# EAGLE design RPi-Adapter (EAGLE 6.6.0)
Assembly variants: RPi-Adapter, Slave-Board

## Sheet 1 of 6: RaspberryPi 3 Interface Hardware Prozessor Der RaspberryPi3 ist ein Ein-Platinen-Computer auf der Grundlage der ARM-Prozessorarchitektur. welche durch die Firma Broadcom lizensiert und im SoC BCM2837 <https://www.raspberrypi.org/wp-content/uploads/2012/02/BCM2835-ARM-Peripherals.pdf> implementiert wurde. Es handelt sich dabei um eine Quad-Core-SMP-Architektur mit einem Basistakt von 1.2Ghz und einer Adressbreite von 64-Bit. GPU Der BCM2835-Prozessor ist als System-On-Chip konzipiert und stellt einen Grafikprozessor auf der Grundlage der Broadcom-VideoCore IV <http://elinux.org/Raspberry_Pi_VideoCore_APIs> IP bereit. Diese ist in der Lage, Full-HD-Videos abzuspielen und stellt auch OpenGL ES 2.0 bzw. OpenVG für Anwendungen bereit. Speicher Wie für fast jegliche Art von Computersystem ist auch für den RaspberryPi3 eine Speicherhierarchie definiert. Der schnelle, aber flüchtige Arbeitsspeicher (RAM) des RaspberryPi ist mit 900Mhz getaktet (LPDDR2) und steht in einer Kapazität von 1GB bereit. Das langsame, aber persistente Halten von Daten wird durch eine externe SD-Karte realisiert. Netzwerk Ein wesentlicher Unterschied neben der erhöhten Performance gegenüber dem RaspberryPi2 ist eine neu hinzugekommene Wireless-Funktionalität. So ist der RPi3 bereits im Auslieferungszustand in der Lage, Bluetooth-LowEnergy und WLAN-Verbindungen (IEEE802.11n) herzustellen. Diese Funktionalität wird über den Chipsatz BCM43143 <http://www.cypress.com/file/298756/download> realisiert. Zusätzlich steht wie in den Vorgängermodellen des RPi eine RJ45-Schnittstelle bereit, über die 100MBit-Ethernetverbindungen hergestellt werden können. Peripherie Zusätzliche Komponenten des RaspberryPi3 sind die erweiterte Anzahl von USB-Schnittstellen (4x USB 2.0 gegenüber den 2xUSB1.1 vom ursprünglichen Board aus dem Jahre 2012), welche über das Bauteil SMSC LAN 9514 <http://ww1.microchip.com/downloads/en/DeviceDoc/9514.pdf> realisiert wird (dieses implementiert gleichzeitig auch den Ethernet-Stack). Daneben ist für den RPi3 auch eine CSI-Kameraschnittstelle für serielle Datenübertragung von HD-Kameramodulen vorgesehen, mit der entsprechende Kameramodule hochauflösend an den BCM-Prozessor angebunden werden können. Zur Darstellung der Benutzeroberfläche dient eine HDMI- und eine DSI-Displayschnittstelle, über die mittels Differenzsignalen hochfrequent und störungsfrei Daten zu Displays übertragen werden können (LVDS). Dies entspricht im Wesentlichen dem Verhalten der HDMI-Schnittstelle, welche zum Anschluss externer Monitore bereitsteht und deren LVDS-Signale durch die oben genannte VideoCore-GPU generiert werden. Zur Ausgabe akustischer Signale (Soundkarte) steht ein kombinierter A/V-Adapter zur Verfügung, der durch eine 3.5mm Klinkenstecker eine Stereoausgabe ermöglicht. Zusätzlich wird über einen dritten Kanal ein Composite-Videosignal (PAL/NTSC) bereitgestellt, was zur Videoausgabe auf nicht-HDMI-kompatibler Hardware verwendet werden kann. Erweiterungen Für das hier dokumentierte Projekt ist allerdings eine andere Eigenschaft des RaspberryPi entscheidend: der RaspberryPi 3 besitzt nämlich eine 40-polige Steckerleiste zur Anbindung externer Peripherie. Darüber können universell benutzbare Ein-/Ausgabe-Pins (GPIO=General Purpose I/O) mit LVTTL Pegeln (3.3V) geschaltet bzw. hochohmig gelesen werden. Manche dieser GPIO Pins besitzen eine Doppelbelegung, die bei Konfiguration der richtigen Register des BroadCom-SoCs die Zweitfunktionalität freischaltet. Dies betrifft z.B. Platinenbusse wie SPI oder I²C, die Ansteuerung von RS232-/ oder RS485-Treibern (UART), aber auch die Generierung von externen Signalformen mittels Hardware-unterstützter Pulsweitenmodulation (PWM). Maximal belastbar sind die GPIO-Ausgabekanäle mit 50mA, was zum direkten Schalten von LEDs ausreicht, für größere Lasten aber Bipolar- bzw. Feldeffekttransistoren benötigt. Betriebssystem Der RaspberryPi kann mit verschiedenen Betriebssystemen betrieben werden. Unter anderem stehen verschiedene Linux-Distributionen wie Raspbian oder das für MediaCenter optimierte OpenELEC <http://www.openelec.tv> zur Verfügung. Auch eine Verwendung mit Microsoft-Plattformen ist möglich, so kann etwa auch Windows10-IoT <https://developer.microsoft.com/de-de/windows/iot> für den RaspberryPi3 verwendet werden. Programmierung Zur Programmierung eigener Anwendungen ist für Linux-Betriebssysteme die Programmiersprache Python <http://www.python.org> das Mittel der Wahl. Sie stellt eine sehr einfache und für Einsteiger leicht zu erlernende Syntax bereit und kann durch PyQT <https://riverbankcomputing.com/software/pyqt/intro> leicht grafische Anwendungen erzeugen. Zur Ansteuerung der GPIOs kann die Softwarekomponente WiringPi <http://raspberrypiguide.de/howtos/raspberry-pi-gpio-how-to/> genutzt werden. Neben Python stehen auch Compiler für Programmiersprachen wie C/C++, Java oder ADA <http://www.adacore.com/press/adacore-introduces-gnat-gpl-2015-for-the-raspberry-pi-2/> bereit. Für die Verwendung von Windows 10 IoT muss statt dessen das VisualStudio 2015 <https://developer.microsoft.com/en-us/windows/iot/docs/setuppcrpi> verwendet werden. Damit wird eine Programmierung mit C# und dem .NET Framework möglich.
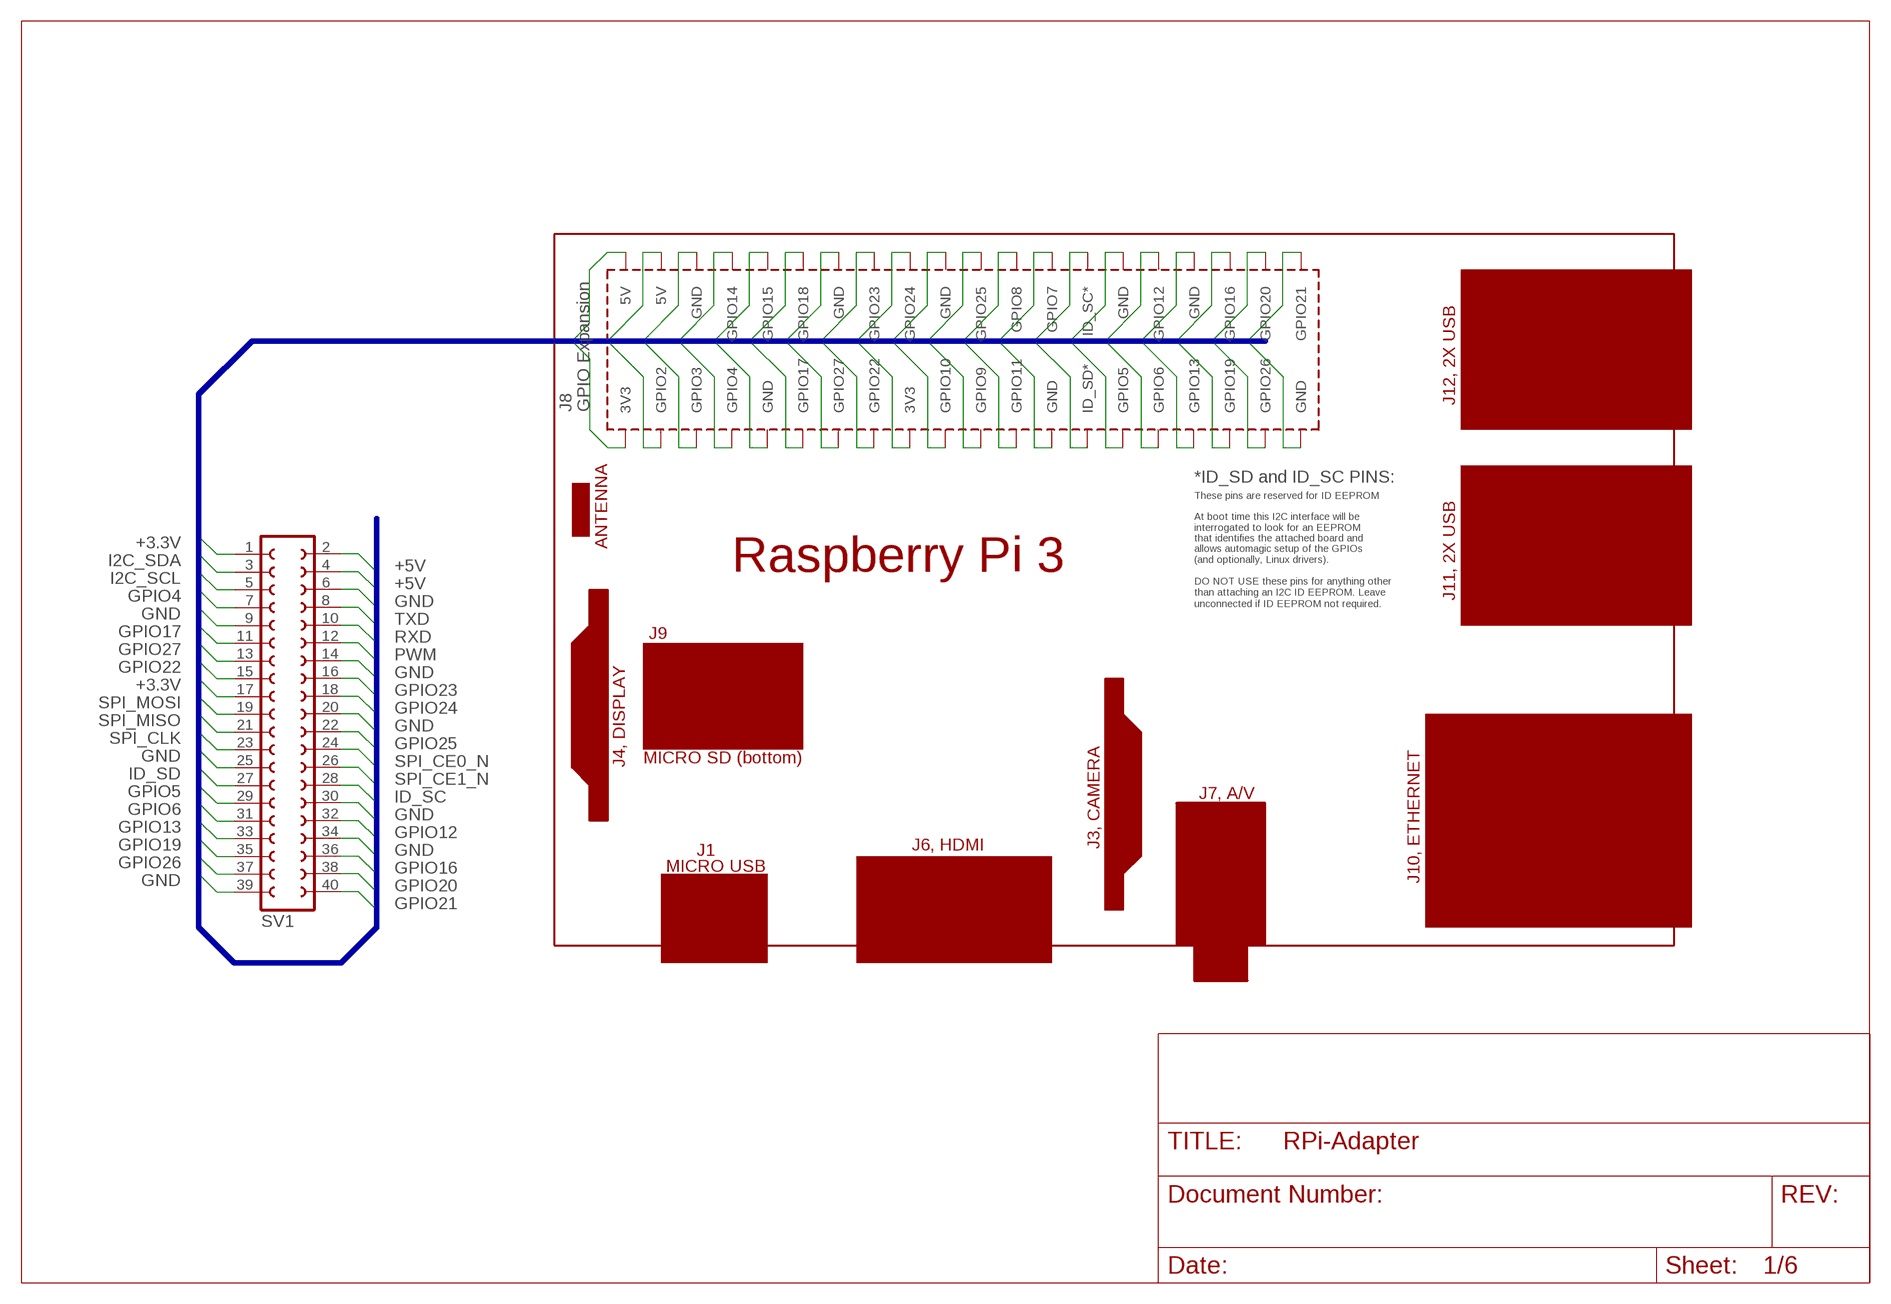
[diagram p0: schematic, sheet 1]

### Parts
PCB1  RPI3_EXT  (no package)
SV1  FE20-2  [FE20-2]  (not fitted in variant Slave-Board)

### Nets
+3.3V: PCB1.3V3 SV1.1 SV1.17 ; also sheet 2,3,5,6
+5V: PCB1.5V SV1.2 SV1.4 ; also sheet 3
GND: PCB1.GND SV1.6 SV1.9 SV1.14 SV1.20 SV1.25 SV1.30 SV1.34 SV1.39 ; also sheet 2,3,4,5,6
GPIO4: PCB1.GPIO4 SV1.7 ; also sheet 2,4
GPIO5: PCB1.GPIO5 SV1.29
GPIO6: PCB1.GPIO6 SV1.31
GPIO12: PCB1.GPIO12 SV1.32
GPIO13: PCB1.GPIO13 SV1.33
GPIO16: PCB1.GPIO16 SV1.36
GPIO17: PCB1.GPIO17 SV1.11
GPIO19: PCB1.GPIO19 SV1.35
GPIO20: PCB1.GPIO20 SV1.38
GPIO21: PCB1.GPIO21 SV1.40
GPIO22: PCB1.GPIO22 SV1.15
GPIO23: PCB1.GPIO23 SV1.16
GPIO24: PCB1.GPIO24 SV1.18
GPIO25: PCB1.GPIO25 SV1.22
GPIO26: PCB1.GPIO26 SV1.37
GPIO27: PCB1.GPIO27 SV1.13
I2C_SCL: PCB1.GPIO3 SV1.5 ; also sheet 2,3,4,5
I2C_SDA: PCB1.GPIO2 SV1.3 ; also sheet 2,3,4,5
ID_SC: PCB1.ID_SC* SV1.28
ID_SD: PCB1.ID_SD* SV1.27
PWM: PCB1.GPIO18 SV1.12 ; also sheet 3
RXD: PCB1.GPIO15 SV1.10 ; also sheet 3
SPI_CE0_N: PCB1.GPIO8 SV1.24 ; also sheet 3
SPI_CE1_N: PCB1.GPIO7 SV1.26 ; also sheet 3
SPI_CLK: PCB1.GPIO11 SV1.23 ; also sheet 3
SPI_MISO: PCB1.GPIO9 SV1.21 ; also sheet 3
SPI_MOSI: PCB1.GPIO10 SV1.19 ; also sheet 3
TXD: PCB1.GPIO14 SV1.8 ; also sheet 3

### Buses
+5V,+3.3V,GND,ID_SD,ID_SC,I2C_SDA,I2C_SCL,GPIO4,GPIO5,GPIO6,SPI_CE1_N,SPI_CE0_N,SPI_MISO,SPI_MOSI,SPI_CLK,GPIO12,GPIO13,TXD,RXD,GPIO16,GPIO17,PWM,GPIO19,GPIO20,GPIO21,GPIO22,GPIO23,GPIO24,GPIO25,GPIO26,GPIO27

## Sheet 2 of 6: GPIO-Extender Hauptkomponente des Projekts ist der integrierte Schaltkreis MCP23017 <http://cdn-reichelt.de/documents/datenblatt/A200/DS_MCP23017.pdf>, der als GPIO-Extender fungiert und über den I²C-Bus vom RaspberryPi aus gesteuert werden kann. Die wesentliche Aufgabe des Bausteins ist die Behebung der Limitierung von I/O-Ports. Der RaspberryPi kann als I²C-Master theoretisch bis zu 127 Slaves adressieren, die Einschränkung soll hier bei maximal 8 Teilnehmern liegen. Der MCP23017 unterstützt zwei Kanäle mit je einer Breite von 8-Bit. Durch Konfiguration eines Datenrichtungsregisters können deren Pins zwischen Input- und Output umgeschaltet werden.
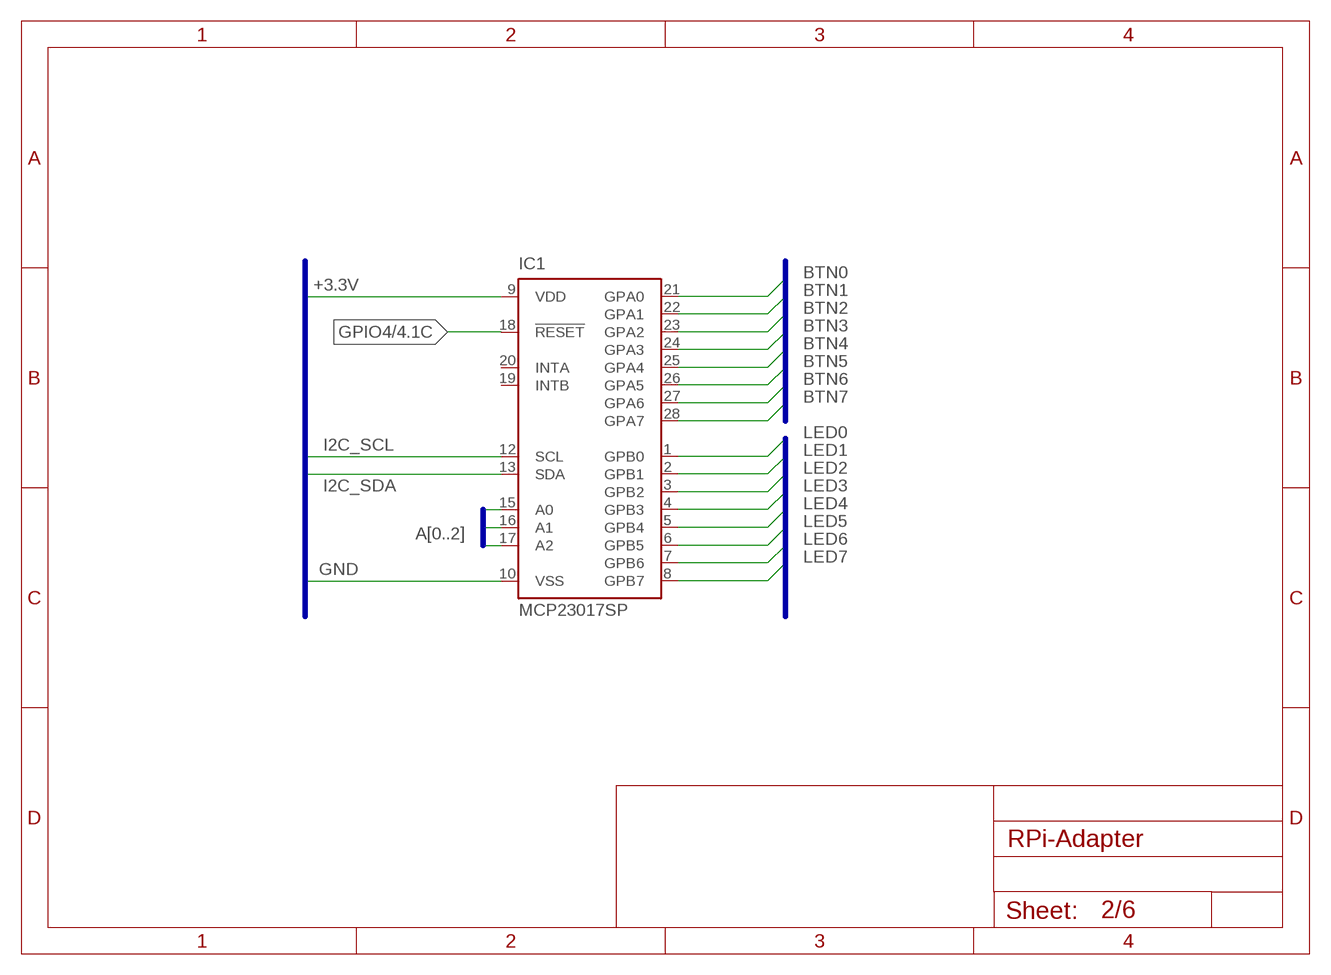
[diagram p1: schematic, sheet 2]

### Parts
IC1  MCP23017SP  [DIL28-3]

### Nets
+3.3V: IC1.9(VDD) ; also sheet 1,3,5,6
A0: IC1.15(A0) ; also sheet 5
A1: IC1.16(A1) ; also sheet 5
A2: IC1.17(A2) ; also sheet 5
BTN0: IC1.21(GPA0) ; also sheet 3
BTN1: IC1.22(GPA1) ; also sheet 3
BTN2: IC1.23(GPA2) ; also sheet 3
BTN3: IC1.24(GPA3) ; also sheet 3
BTN4: IC1.25(GPA4) ; also sheet 3
BTN5: IC1.26(GPA5) ; also sheet 3
BTN6: IC1.27(GPA6) ; also sheet 3
BTN7: IC1.28(GPA7) ; also sheet 3
GND: IC1.10(VSS) ; also sheet 1,3,4,5,6
GPIO4: IC1.18(!RESET) ; also sheet 1,4
I2C_SCL: IC1.12(SCL) ; also sheet 1,3,4,5
I2C_SDA: IC1.13(SDA) ; also sheet 1,3,4,5
LED0: IC1.1(GPB0) ; also sheet 3
LED1: IC1.2(GPB1) ; also sheet 3
LED2: IC1.3(GPB2) ; also sheet 3
LED3: IC1.4(GPB3) ; also sheet 3
LED4: IC1.5(GPB4) ; also sheet 3
LED5: IC1.6(GPB5) ; also sheet 3
LED6: IC1.7(GPB6) ; also sheet 3
LED7: IC1.8(GPB7) ; also sheet 3
Unconnected: IC1.19(INTB) IC1.20(INTA)

### Buses
BTN[0..7]
LED[0..7]
+5V,+3.3V,GND,ID_SD,ID_SC,I2C_SDA,I2C_SCL,GPIO4,GPIO5,GPIO6,GPIO7,GPIO8,GPIO9,GPIO10,GPIO11,GPIO12,GPIO13,GPIO14,GPIO15,GPIO16,GPIO17,PWM,GPIO19,GPIO20,GPIO21,GPIO22,GPIO23,GPIO24,GPIO25,GPIO26,GPIO27
A[0..2]

## Sheet 3 of 6: Expansion-Header Die Expansion-Header entsprechen Stiftleisten zur Erweiterung der Funktionalität. So können für ein bestimmte Einsatzzweck erstellte Lochraster- bzw. Platinenaufbauten mit dem Board verwendet werden, solange sie den gleichen Footprint verwenden und die elektrischen Gegebenheiten passend antizipieren.
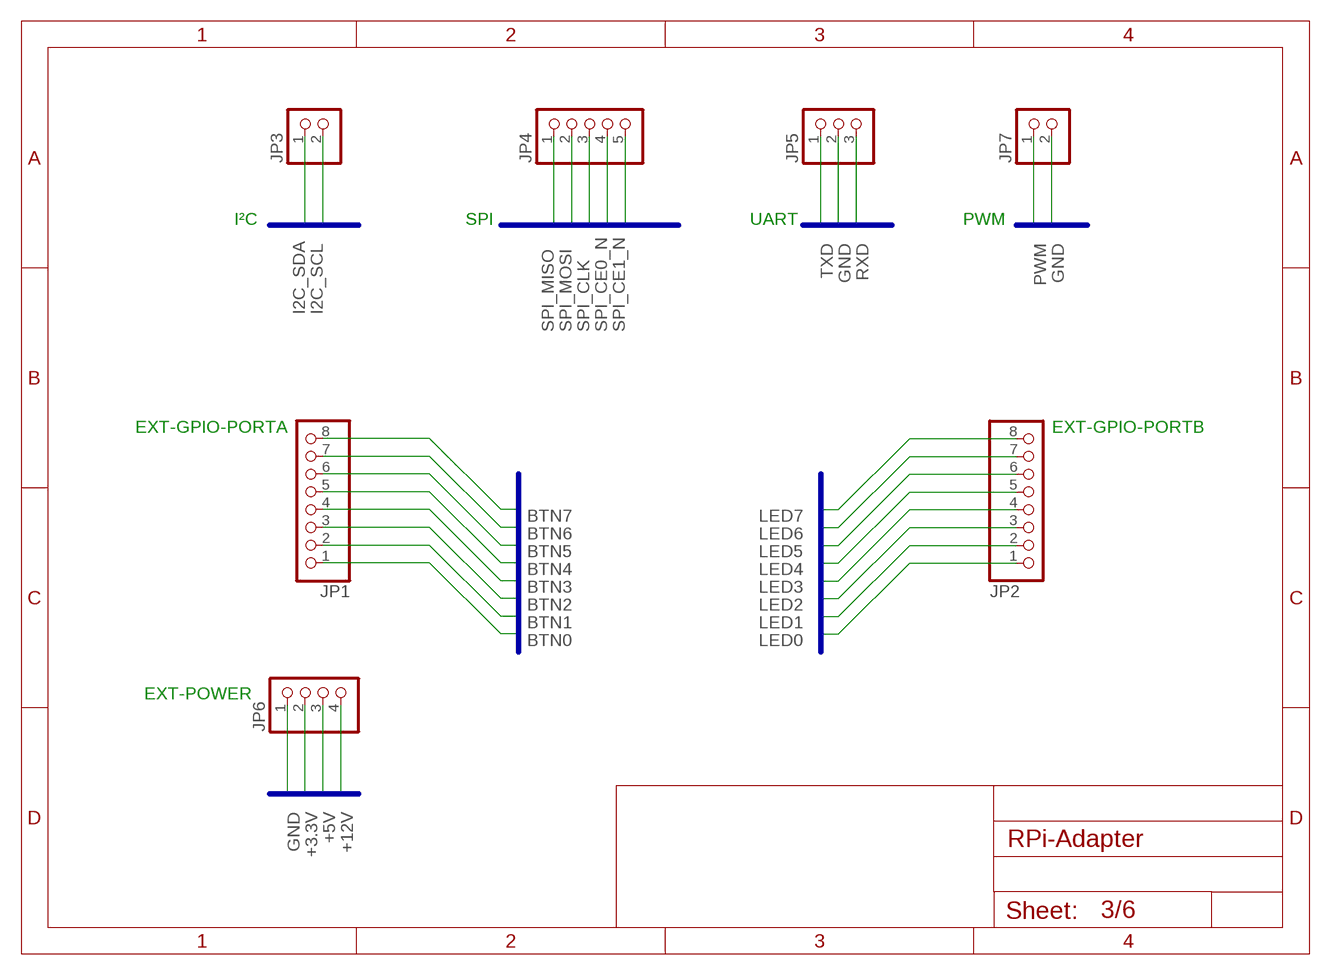
[diagram p2: schematic, sheet 3]

### Parts
JP1  PINHD-1X8  [1X08]
JP2  PINHD-1X8  [1X08]
JP3  PINHD-1X2  [1X02]
JP4  PINHD-1X5  [1X05]
JP5  PINHD-1X3  [1X03]
JP6  PINHD-1X4  [1X04]
JP7  PINHD-1X2  [1X02]

### Nets
+3.3V: JP6.2 ; also sheet 1,2,5,6
+5V: JP6.3 ; also sheet 1
+12V: JP6.4 ; also sheet 4,6
BTN0: JP1.1 ; also sheet 2
BTN1: JP1.2 ; also sheet 2
BTN2: JP1.3 ; also sheet 2
BTN3: JP1.4 ; also sheet 2
BTN4: JP1.5 ; also sheet 2
BTN5: JP1.6 ; also sheet 2
BTN6: JP1.7 ; also sheet 2
BTN7: JP1.8 ; also sheet 2
GND: JP5.2 JP6.1 JP7.2 ; also sheet 1,2,4,5,6
I2C_SCL: JP3.2 ; also sheet 1,2,4,5
I2C_SDA: JP3.1 ; also sheet 1,2,4,5
LED0: JP2.1 ; also sheet 2
LED1: JP2.2 ; also sheet 2
LED2: JP2.3 ; also sheet 2
LED3: JP2.4 ; also sheet 2
LED4: JP2.5 ; also sheet 2
LED5: JP2.6 ; also sheet 2
LED6: JP2.7 ; also sheet 2
LED7: JP2.8 ; also sheet 2
PWM: JP7.1 ; also sheet 1
RXD: JP5.3 ; also sheet 1
SPI_CE0_N: JP4.4 ; also sheet 1
SPI_CE1_N: JP4.5 ; also sheet 1
SPI_CLK: JP4.3 ; also sheet 1
SPI_MISO: JP4.1 ; also sheet 1
SPI_MOSI: JP4.2 ; also sheet 1
TXD: JP5.1 ; also sheet 1

### Buses
BTN[0..7]
+12V,+5V,+3.3V,GND
LED[0..7]
I2C_SDA,I2C_SCL
SPI_CE1_N,SPI_CE0_N,SPI_MISO,SPI_MOSI,SPI_CLK
TXD,RXD,GND
PWM,GND

### Notes on the sheet
- I²C | SPI | UART | PWM
- EXT-GPIO-PORTA | EXT-GPIO-PORTB
- EXT-POWER

## Sheet 4 of 6: RJ-45-Steckverbinder Zur Verbindung von Busteilnehmern kommen RJ-45-Steckverbinder zum Einsatz, die in der Netzwerktechnik weit verbreitet sind und daher leicht verfügbar bzw. erweiterbar sind. Das betrifft hauptsächlich die einfache und wartungsfreie Montage von Slave-Modulen im Gesamtsystem des Messeaufbaus. Keine Kompatibilität zu Ethernet-Switches/-Hubs! Die Belegung der RJ-45-Buchse ist proprietär und inkompatibel zu Ethernet. Konkret leisten muss die RJ45-Buchse: Masseverbindung Reserviert I²C-Clock (+3.3V LVTTL) I²C-Data (+3.3V LVTTL) +12V DC-Versorgungsspannung Reset (Low-Active, +3.3V LVTTL) Reserviert Reserviert Somit wird sichergestellt, dass selbst bei Verklemmung des I²C-Busses, ein durch den I²C-Master gesteuertes Reset ausgelöst werden kann. Die restlichen Aufgaben sind Datentransport und Bereitstellung einer gemeinsamen Spannungsquelle für alle Slaves. Die handelsüblichen Cat5-Kabel bieten für dieses kleine I²C-Bussystem auch den Vorteil einer recht hohen Abschirmung gegenüber HF-Einströmungen, da die Adern paarweise geschirmt sind (Twisted-Pair). Damit sollte eine für PWM ausreichend hohe Taktung des I²C-Busses auch über mal 2-3m hin gewährleistet sein.
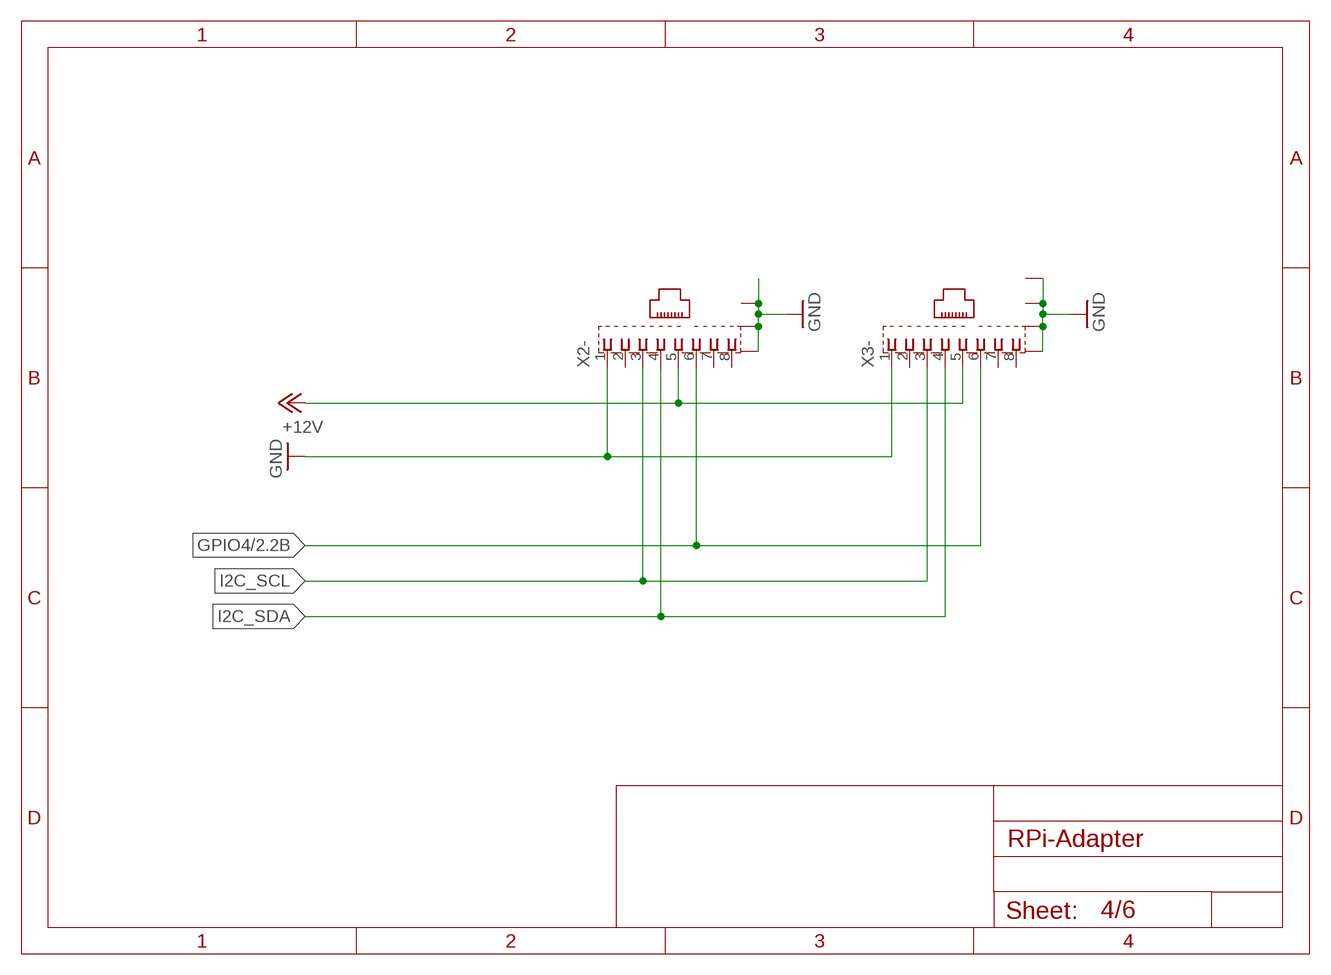
[diagram p3: schematic, sheet 4]

### Parts
X2  RJ45  [RJ45]
X3  RJ45  [RJ45]

### Nets
+12V: X2.5 X3.5 ; also sheet 3,6
GND: X2.1 X2.G1 X2.G2 X2.G3 X3.1 X3.G1 X3.G2 X3.G3 X3.G4 ; also sheet 1,2,3,5,6
GPIO4: X2.6 X3.6 ; also sheet 1,2
I2C_SCL: X2.3 X3.3 ; also sheet 1,2,3,5
I2C_SDA: X2.4 X3.4 ; also sheet 1,2,3,5
Unconnected: X2.2 X2.7 X2.8 X2.G4 X3.2 X3.7 X3.8

## Sheet 5 of 6: I²C-Bus Zur Kommunikation zwischen RaspberryPi und den angeschlossenen Verbrauchern dient der Philips entwickelte I²C-Bus, der ähnlich wie der SPI-Bus zur Kommunikation zwischen IC auf und zwischen Leiterplatten dient (I²C=Inter-Integrated-Circuits). Aus diesem Design folgen ein paar ernsthafte Limitierungen: Der I²C-Bus ist nicht differentiell, d.h. es wird nicht wie etwa bei CAN- oder RS485 mit zwei Datenpotentialen (D+, D-) gearbeitet, deren Differenzspannung vom Empfänger gebildet wird. I²C ist somit anfällig für Gleichtaktstörungen (z.B. Zündfunken), hat aufgrund der niedrigen (LV)TTL-Pegel eine begrenzte Reichweite und benötigt ähnlich wie die RS232 immer eine gemeinsame Masse als Bezugspotential. I²C ist ein getakteter Bus I²C ist ein Master-Slave-Bussystem Anzahl Teilnehmer ist auf 127 begrenzt Datenbreite für Register ist im Durchschnitt bei 16-Bit (implementierungabhängig) Terminierung erforderlich Datenraten von bis zu 5Mbit/s möglich serieller Bus (MSB-first Übertragung) Diese Master-Slave-Busarchitektur ermöglicht es dem Master, zyklisch Werte vom Bus abzufragen (Polling). Manche IC-Implementierungen ermöglichen zusätzlich die Verwendung von externen Interrupt-Pins, welche OnChange-Ereignisse signalisieren können. Aufgrund der dadurch resultierenden Verdrahtungskomplexität bietet sich das allerdings nur in speziellen Anwendungsfällen an, wo z.B. ein preiswerter und leistungsbegrenzter 8-Bit-Mikrocontroller (möglicherweise mit Optimierung auf maximale Batterielaufzeit) aufgrund eigener Resourcenrestriktionen und anderen integrierten Funktionen nicht ständig auf den I²C-Bus pollen kann. Aus der Perspektive des RaspberryPi als I²C-Master bietet sich I²C sehr an, da mit den i2c-tools und den Linux-Kernel-Modul i2c-bcm2708 eine sehr leistungsstarke und komfortable Schnittstelle zur Arbeit mit I²C bereit steht. Die sehr gute Linux-Unterstützung für I²C rührt u.a. historisch auch daher, dass viele Temperatur-Sensoren auf PC-Mainboards über dieses Protokoll adressiert wurden (Stichwort lm-sensors). Die I²C-Slaves als Teilnehmer müssen mit eindeutigen Adressen kodiert sein. Zu diesem Zweck dienen beim MCP23017 die Pins A[0..2], wodurch sich 2³=8 Teilnehmer unterscheiden lassen. Die Slave-Adressierung wird durch den montierten DIP-Schalter durchgeführt.
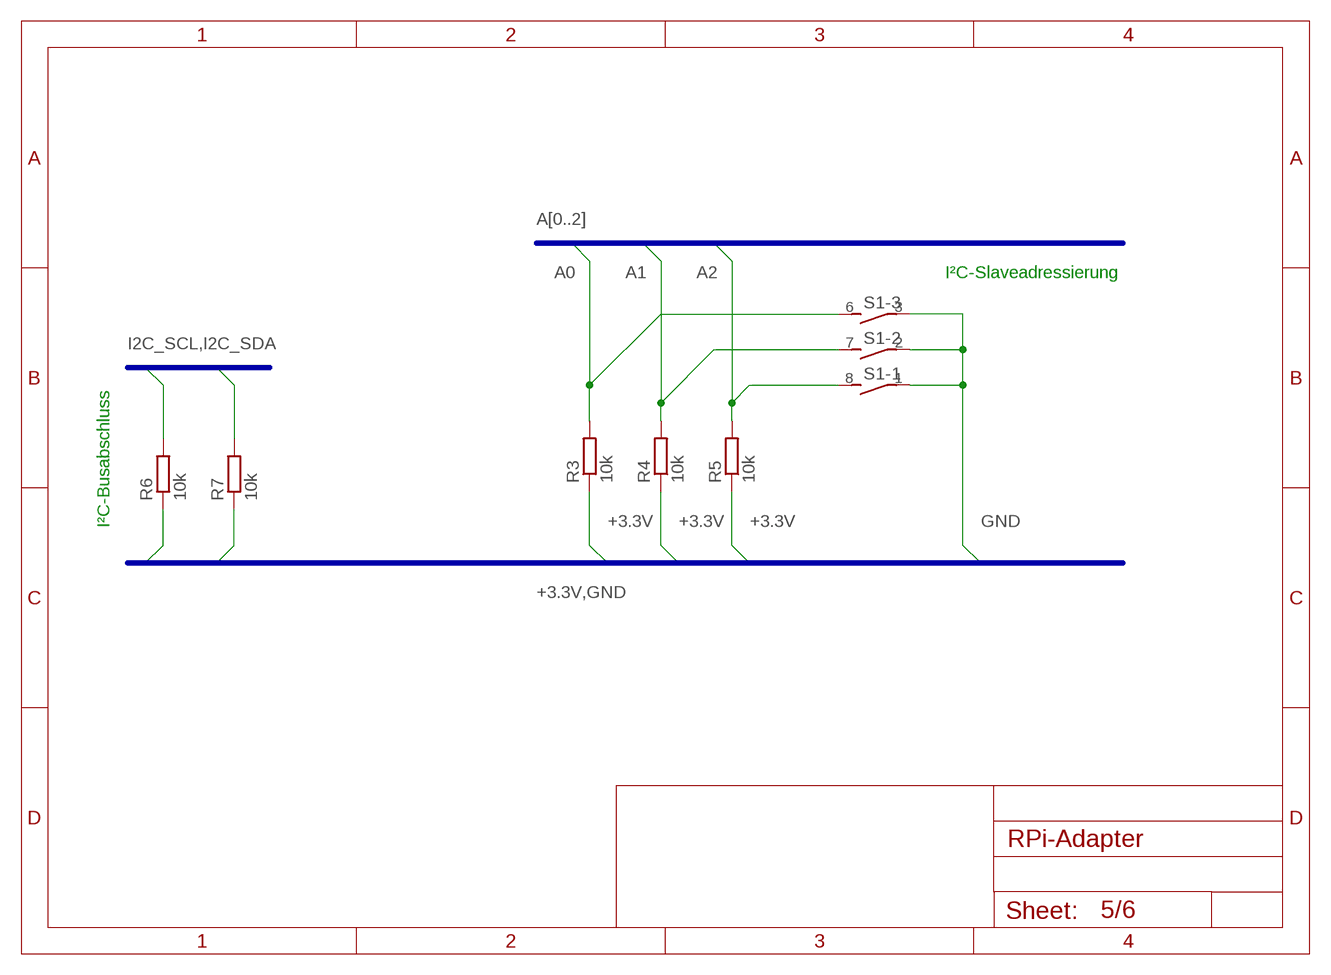
[diagram p4: schematic, sheet 5]

### Parts
R3  10k  R-EU_R0805  [R0805]
R4  10k  R-EU_R0805  [R0805]
R5  10k  R-EU_R0805  [R0805]
R6  10k  R-EU_R0805  [R0805]
R7  10k  R-EU_R0805  [R0805]
S1  DIP04S  [DIP04S]

### Nets
+3.3V: R3.1 R4.1 R5.1 R6.1 R7.1 ; also sheet 1,2,3,6
A0: R3.2 S1.6 ; also sheet 2
A1: R4.2 S1.7 ; also sheet 2
A2: R5.2 S1.8 ; also sheet 2
GND: S1.1 S1.2 S1.3 ; also sheet 1,2,3,4,6
I2C_SCL: R6.2 ; also sheet 1,2,3,4
I2C_SDA: R7.2 ; also sheet 1,2,3,4
Unconnected: S1.4 S1.5

### Buses
+3.3V,GND
A[0..2]
I2C_SCL,I2C_SDA

### Notes on the sheet
- I²C-Slaveadressierung
- I²C-Busabschluss

## Sheet 6 of 6: Versorgung Die Spannungsversorgung ist einheitlich auf +12V DC sichergestellt. Dies zum Einen dem Leistungsteil geschuldet, dessen Verbraucher diese Spannung erfordern, zum Anderen bietet sich dieser Spannungslevel aufgrund der Versorgung durch Kfz-Netzteile etc. an. Eine wichtige Rolle für die Versorgungsspannung spielt der I²C-Bus, der zur Kommunikation zwischen dem RaspberryPi und den Busteilnehmern dient. I²C funktioniert im Gegensatz zu CAN-Bus oder anderen Feldbussystemen wie RS-485 nicht differenziell. Das bedeutet in der Konsequenz, dass sowohl eine gemeinsame Masse, als auch ein gemeinsames Bezugspotential notwendig ist. Der Broadcom-ARM-Prozessor des RaspberryPi verwendet sowohl für GPIOs, als auch für SPI und I²C-Bus ein LVTTL-Pegel, d.h. +3.3V, welche sowohl für den I²C-Takt, als auch für die I²C-Datenleitung gelten. Somit ergibt sich in der Konsequenz, dass als kleinster gemeinsamer Nenner zwischen RaspberryPi und GPIO-Extender beide auf LVTTL betrieben werden sollten. Für diese Zwecke wird ein Low-Drop-Spannungsregler von Texas Instruments vom Typ LM1117 <http://www.ti.com/lit/ds/symlink/lm1117.pdf> eingesetzt.
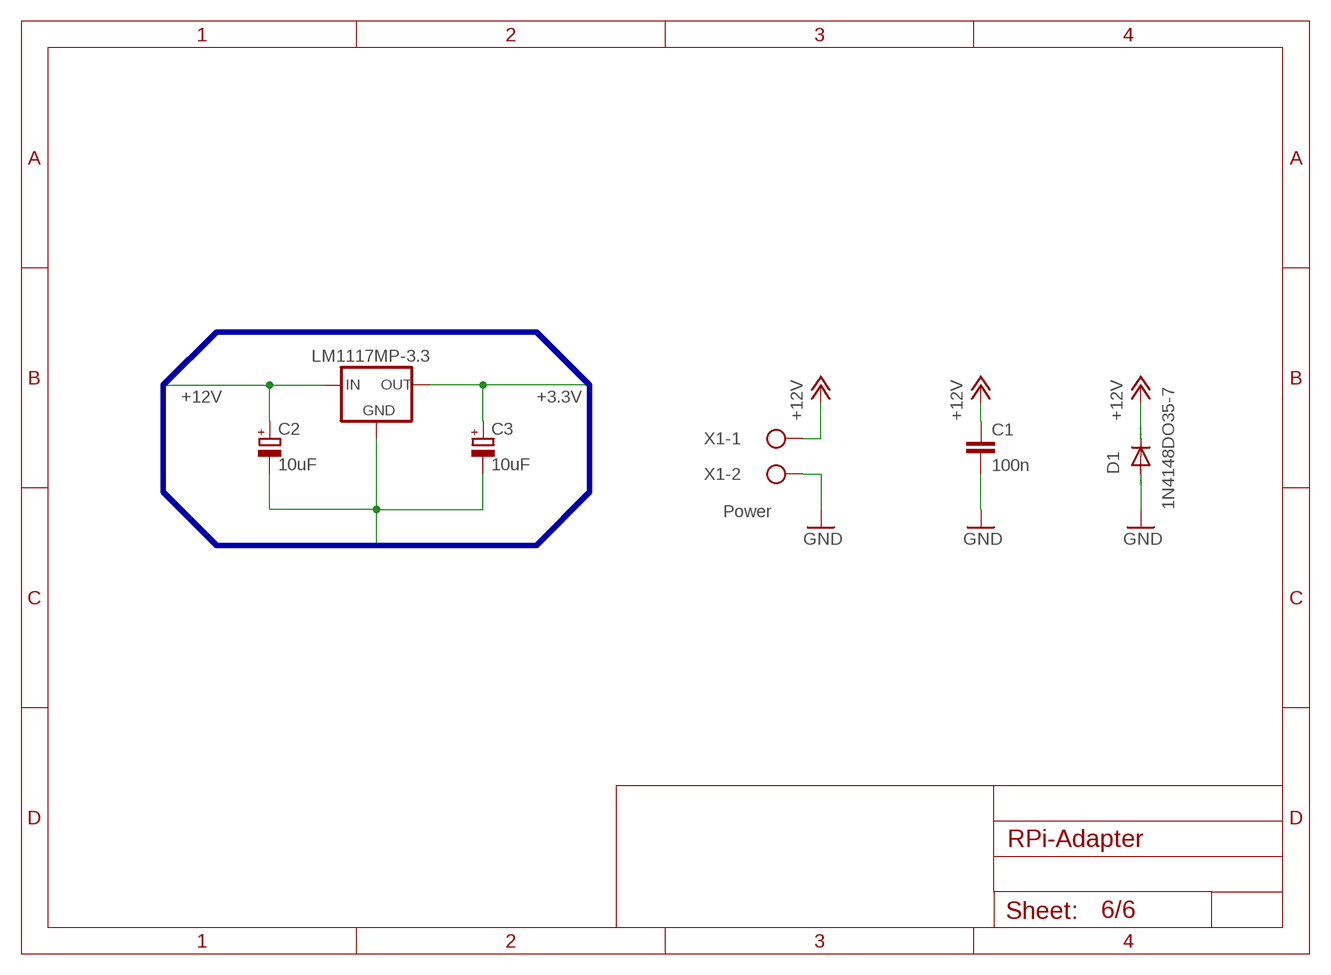
[diagram p5: schematic, sheet 6]

### Parts
C1  100n  C-EUC0805  [C0805]
C2  10uF  CPOL-EU153CLV-0405  [153CLV-0405]
C3  10uF  CPOL-EU153CLV-0405  [153CLV-0405]
D1  1N4148DO35-7  [DO35-7]
IC2  LM1117MP-3.3  [SOT223]
X1  Power  AK500/2  [AK500/2]  (not fitted in variant Slave-Board)

### Nets
+3.3V: C3.+ IC2.2(OUT) IC2.4(OUT) ; also sheet 1,2,3,5
+12V: C1.1 C2.+ D1.C IC2.3(IN) X1.1 ; also sheet 3,4
GND: C1.2 C2.- C3.- D1.A IC2.1(GND) X1.2 ; also sheet 1,2,3,4,5

### Buses
+12V,+5V,+3.3V,GND

## Library data of the parts
C1 = rcl:C-EU: CAPACITOR, European symbol
C2 C3 = rcl:CPOL-EU: POLARIZED CAPACITOR, European symbol
D1 = diode:1N4148: DIODE high speed (Philips)
IC1 = microchip:MCP23017: http://ww1.microchip.com/downloads/en/DeviceDoc/21952a.pdf Source: http://ww1.microchip.com/downloads/en/DeviceDoc/21952a.pdf; MF: MICROCHIP; MPN: MCP23017-E/SP; OC_FARNELL: 1332088; OC_NEWARK: 31K2959
IC2 = lm1117_11:LM1117?-*: 800mA Low-Dropout Linear Regulator Source: http://www.ti.com/lit/ds/symlink/lm1117-n.pdf; MF: Texas Instruments; MPN: LM1117MP-3.3; OC_FARNELL: 9778195; OC_NEWARK: 28X3416
JP1 JP2 = pinhead:PINHD-1X8: PIN HEADER
JP3 JP7 = pinhead:PINHD-1X2: PIN HEADER
JP4 = pinhead:PINHD-1X5: PIN HEADER
JP5 = pinhead:PINHD-1X3: PIN HEADER
JP6 = pinhead:PINHD-1X4: PIN HEADER
PCB1 = e14_Rpi3_RevA:RPI3_EXT: Device for Raspberry Pi 3 without an associated package created by Dave Young for www.element14.com. Intended to allow the addition of a Pi3 in a schematic to show how wired connectins are made to the board without having a footprint on the board. More information available at: https://www.element14.com/community/community/raspberry-pi
R3-R7 = rcl:R-EU_: RESISTOR, European symbol
S1 = switch-dil:DIP04S: DIL/CODE SWITCH; OC_FARNELL: unknown; OC_NEWARK: unknown
SV1 = con-lsta:FE20-2: FEMALE HEADER; OC_FARNELL: unknown; OC_NEWARK: unknown
X1 = con-ptr500:AK500/2: CONNECTOR; OC_FARNELL: unknown; OC_NEWARK: unknown
X2 X3 = con-appsys:RJ45: AMP connector

## Board
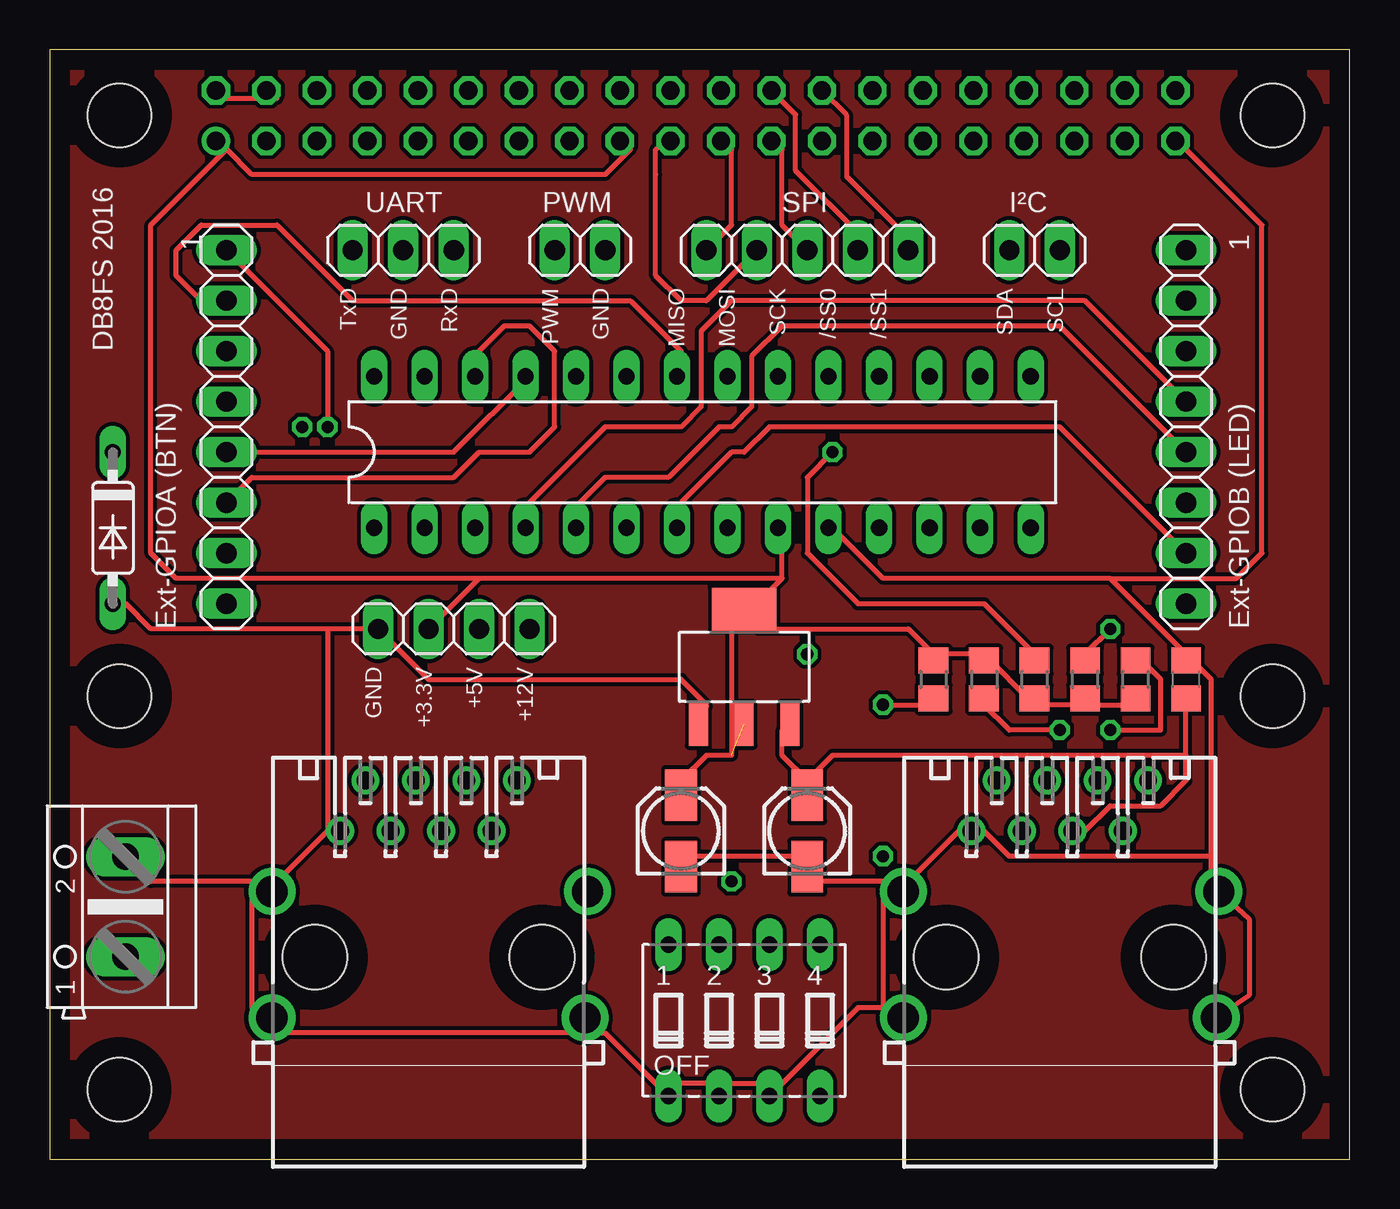
[diagram p6: board, top side]
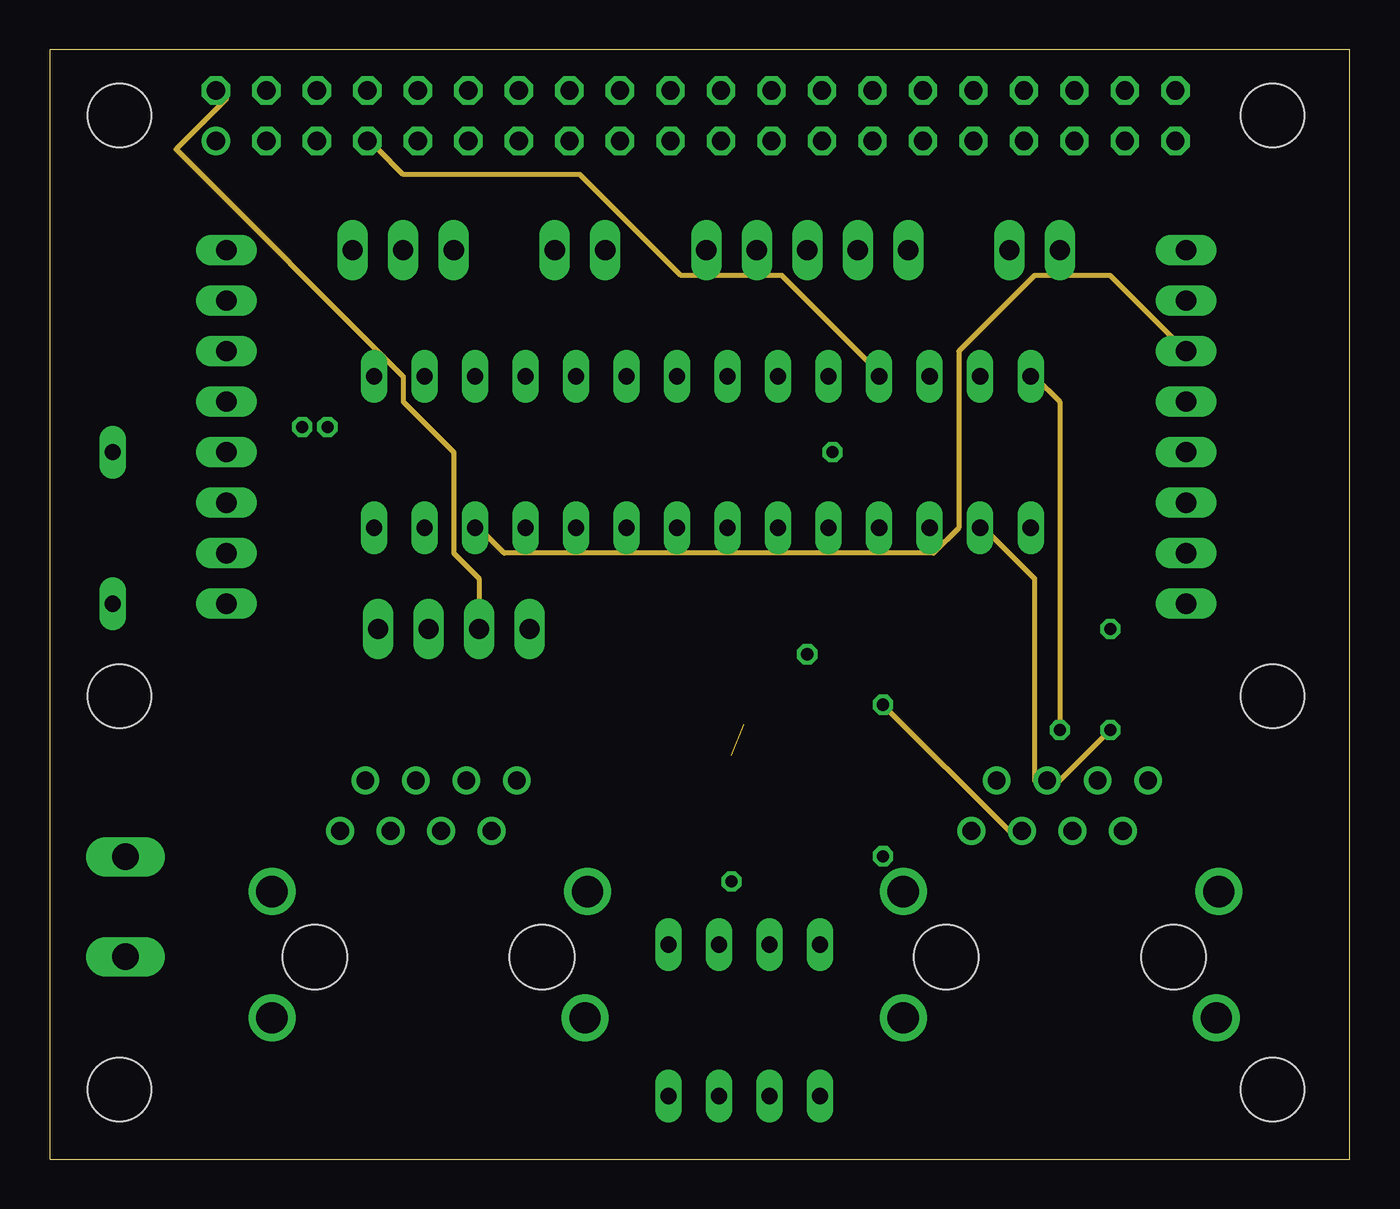
[diagram p7: board, inner layer Route2]
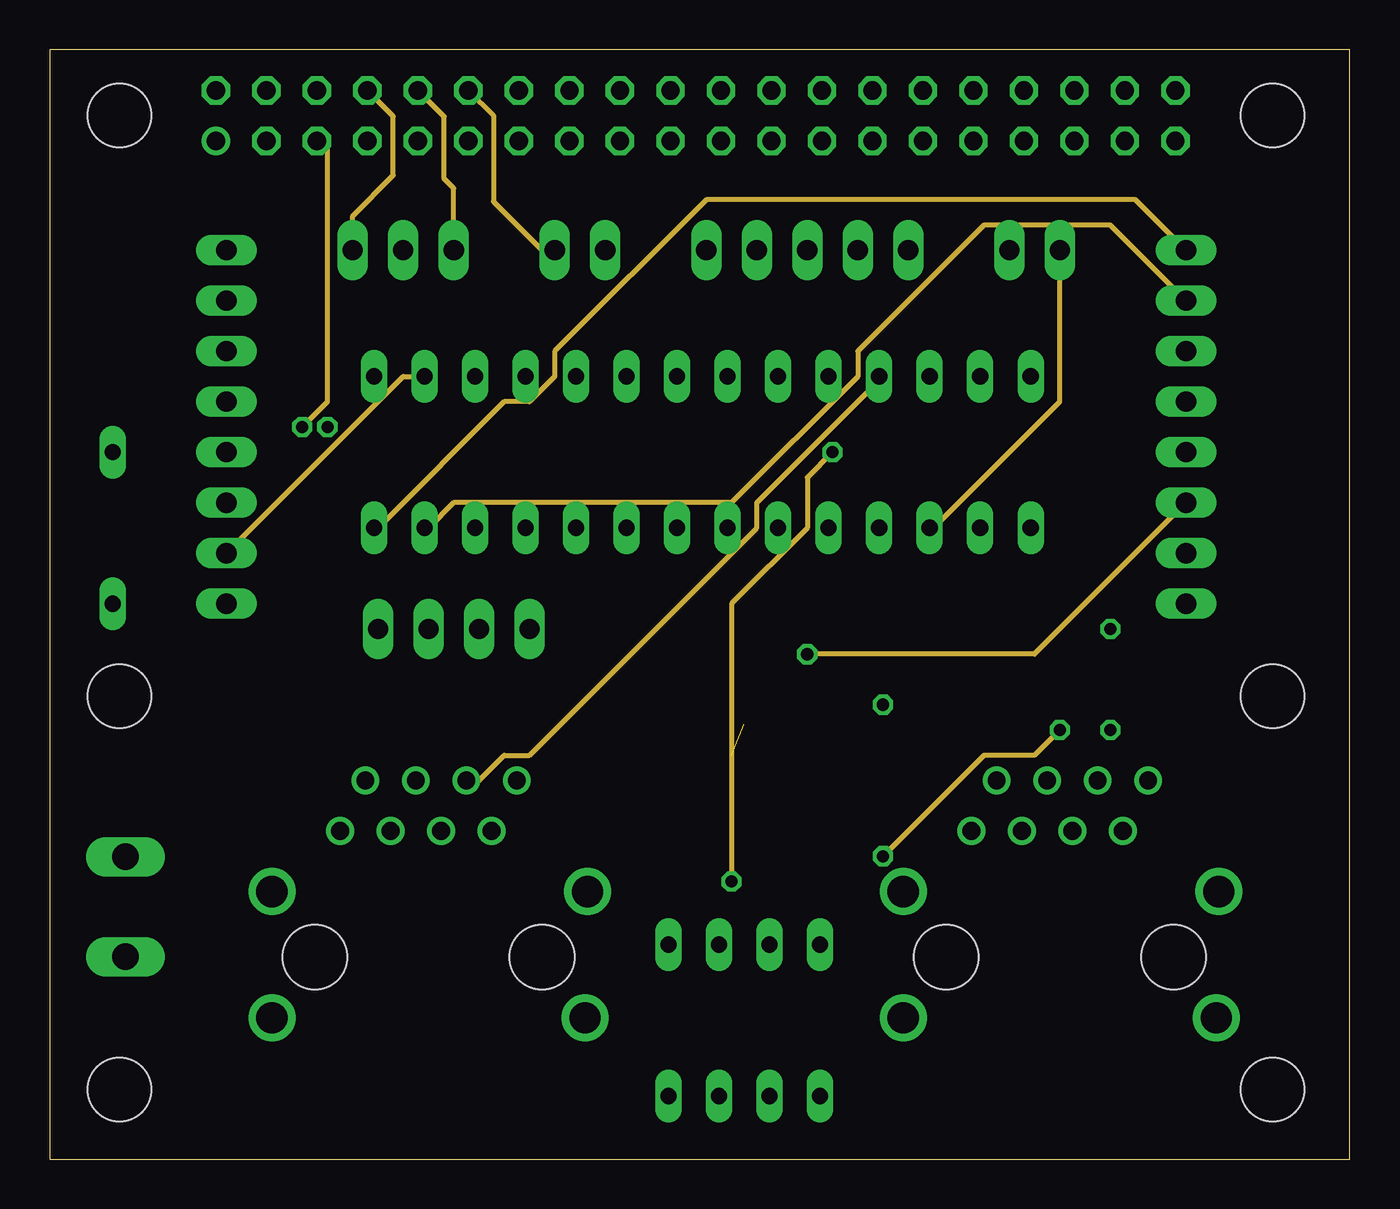
[diagram p8: board, inner layer Route15]
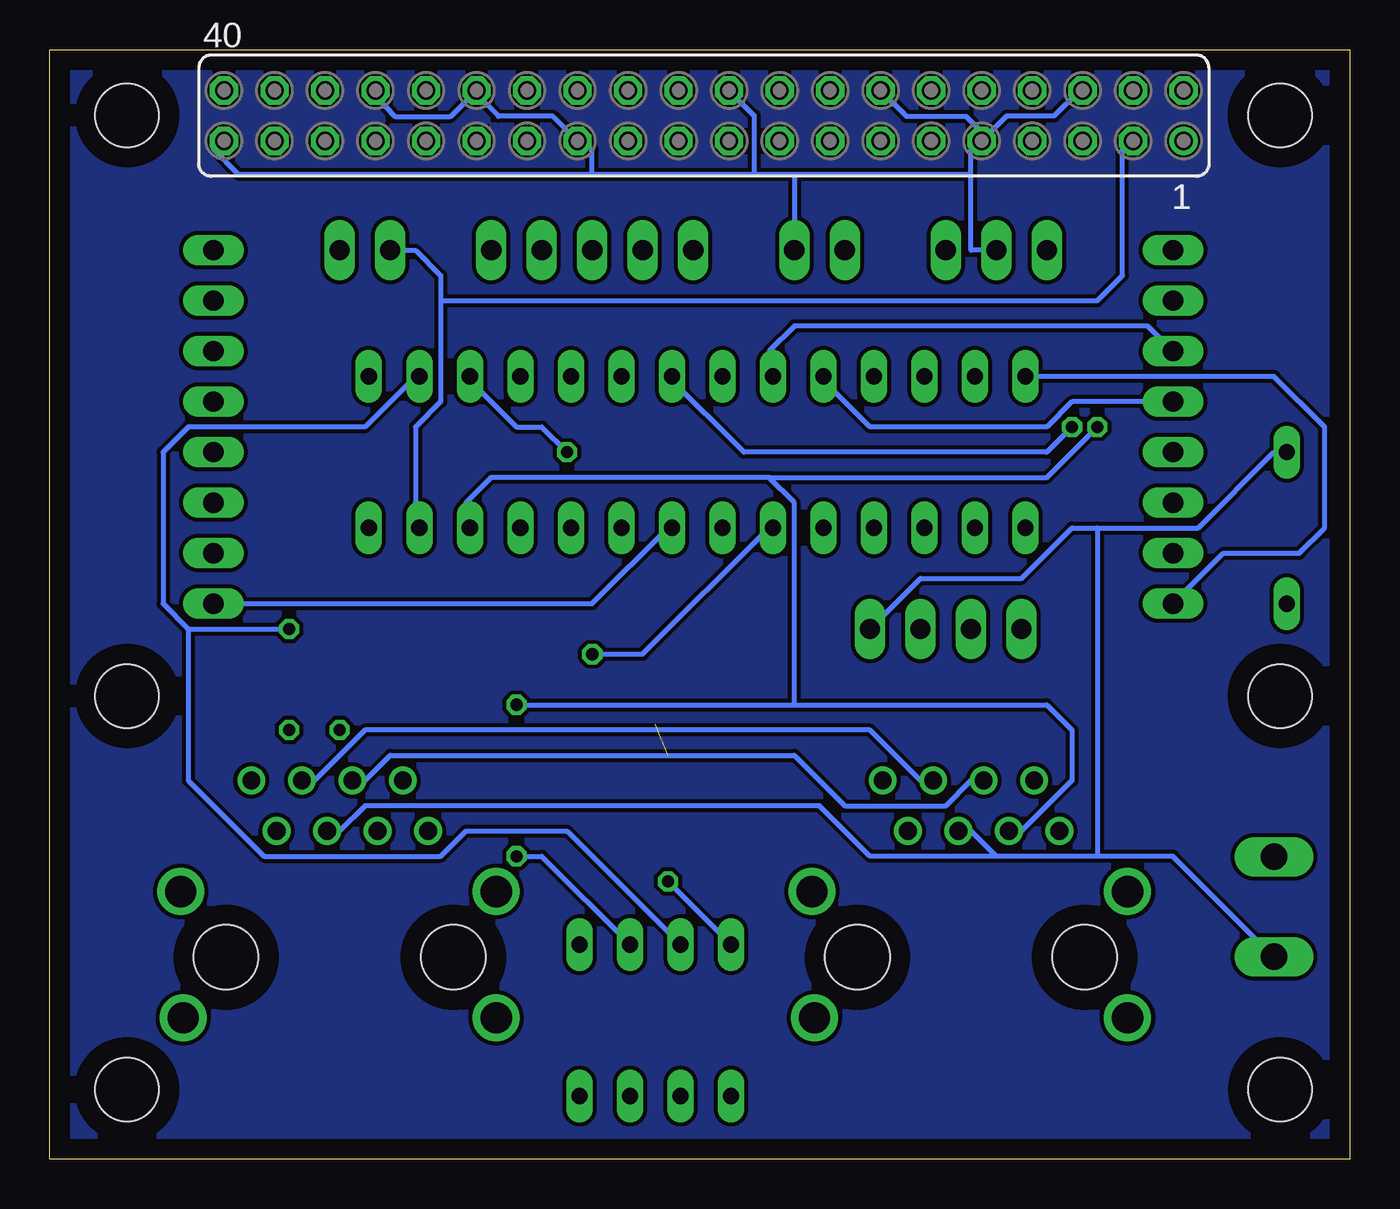
[diagram p9: board, bottom side, seen from below]

Size 65.39 x 55.8 mm. Coordinates in mm from the lower left corner, seen from the top.
Outline: 0,0 65.39,0 65.39,55.8 0,55.8 0,0
Copper layers (1+2*15+16): Top 0.035mm / dielectric 1.5mm / Route2 0.035mm / dielectric 0.15mm / Route15 0.035mm / dielectric 0.2mm / Bottom 0.035mm
Design rules "default *": minimum track width 10mil, minimum drill 24mil, track to track 8mil, track to pad 8mil, pad to pad 8mil, via to via 8mil, smd to smd 8mil, copper to edge 40mil, drill to drill 8mil, minimum pad ring 10mil, minimum via ring 8mil, stop-mask expansion 4mil, vias tented up to drill 0mil, thermal gap 10mil
Holes 3.2 mm at 3.5,3.5 3.51,52.5 61.49,52.5 61.5,3.51 3.51,23.29 61.49,23.29

### Footprints (pad centres in the part's own frame; a part is rotated, then mirrored left to right if it is on the bottom)
C0805 = smd 1.3 x 1.5: 1 -0.95,0; 2 0.95,0
153CLV-0405 = smd 2.6 x 1.6: + 1.8,0; - -1.8,0
DO35-7 = drill 0.813 long: A 3.81,0; C -3.81,0
DIL28-3 = drill 0.813 long: 1 -16.51,-3.81; 2 -13.97,-3.81; 3 -11.43,-3.81; 4 -8.89,-3.81; 5 -6.35,-3.81; 6 -3.81,-3.81; 7 -1.27,-3.81; 8 1.27,-3.81; 9 3.81,-3.81; 10 6.35,-3.81; 11 8.89,-3.81; 12 11.43,-3.81; 13 13.97,-3.81; 14 16.51,-3.81; 15 16.51,3.81; 16 13.97,3.81; 17 11.43,3.81; 18 8.89,3.81; 19 6.35,3.81; 20 3.81,3.81; 21 1.27,3.81; 22 -1.27,3.81; 23 -3.81,3.81; 24 -6.35,3.81; 25 -8.89,3.81; 26 -11.43,3.81; 27 -13.97,3.81; 28 -16.51,3.81
SOT223 = smd 0.95 x 2.15: 1 -2.3,-2.9; 2 0,-2.9; 3 2.3,-2.9 | smd 3.25 x 2.15: 4 0,2.9
1X08 = drill 1.016 long: 1 -8.89,0; 2 -6.35,0; 3 -3.81,0; 4 -1.27,0; 5 1.27,0; 6 3.81,0; 7 6.35,0; 8 8.89,0
1X02 = drill 1.016 long: 1 -1.27,0; 2 1.27,0
1X05 = drill 1.016 long: 1 -5.08,0; 2 -2.54,0; 3 0,0; 4 2.54,0; 5 5.08,0
1X03 = drill 1.016 long: 1 -2.54,0; 2 0,0; 3 2.54,0
1X04 = drill 1.016 long: 1 -3.81,0; 2 -1.27,0; 3 1.27,0; 4 3.81,0
R0805 = smd 1.3 x 1.5: 1 -0.95,0; 2 0.95,0
DIP04S = drill 0.813 long: 1 -3.81,-3.81; 2 -1.27,-3.81; 3 1.27,-3.81; 4 3.81,-3.81; 5 3.81,3.81; 6 1.27,3.81; 7 -1.27,3.81; 8 -3.81,3.81
FE20-2 = drill 0.914: 1 -24.13,1.27 | drill 0.914 octagon: 2 -24.13,-1.27; 3 -21.59,1.27; 4 -21.59,-1.27; 5 -19.05,1.27; 6 -19.05,-1.27; 7 -16.51,1.27; 8 -16.51,-1.27; 9 -13.97,1.27; 10 -13.97,-1.27; 11 -11.43,1.27; 12 -11.43,-1.27; 13 -8.89,1.27; 14 -8.89,-1.27; 15 -6.35,1.27; 16 -6.35,-1.27; 17 -3.81,1.27; 18 -3.81,-1.27; 19 -1.27,1.27; 20 -1.27,-1.27; 21 1.27,1.27; 22 1.27,-1.27; 23 3.81,1.27; 24 3.81,-1.27; 25 6.35,1.27; 26 6.35,-1.27; 27 8.89,1.27; 28 8.89,-1.27; 29 11.43,1.27; 30 11.43,-1.27; 31 13.97,1.27; 32 13.97,-1.27; 33 16.51,1.27; 34 16.51,-1.27; 35 19.05,1.27; 36 19.05,-1.27; 37 21.59,1.27; 38 21.59,-1.27; 39 24.13,1.27; 40 24.13,-1.27
AK500/2 = drill 1.321 long: 1 -2.515,0; 2 2.515,0
RJ45 = drill 0.889: 1 -4.445,6.35; 2 -3.175,8.89; 3 -1.905,6.35; 4 -0.635,8.89; 5 0.635,6.35; 6 1.905,8.89; 7 3.175,6.35; 8 4.445,8.89 | drill 1.575 pad 2.184: G1 -7.874,-3.048; G2 7.874,-3.048; G3 -7.874,3.302; G4 8.001,3.302 | hole 3.251: -5.715,0; 5.715,0

### Placement (x,y rotation side)
C1  57.15,24.13 90 top
C2  38.1,16.51 90 top
C3  31.75,16.51 90 top
D1  3.17,31.75 270 top
IC1  32.82,35.57 0 top
IC2  34.92,24.77 0 top
JP1  8.89,36.83 270 top
JP2  57.15,36.83 270 top
JP3  49.53,45.72 0 top
JP4  38.1,45.72 0 top
JP5  17.78,45.72 0 top
JP6  20.32,26.67 0 top
JP7  26.67,45.72 0 top
R3  46.99,24.13 270 top
R4  52.07,24.13 90 top
R5  49.53,24.13 90 top
R6  44.45,24.13 270 top
R7  54.61,24.13 90 top
S1  34.92,6.99 0 top
SV1  32.49,52.48 180 bottom
X1  3.81,12.7 90 top
X2  19.05,10.16 0 top
X3  50.8,10.16 0 top

### Tracks (layer width: path | path; a pad name or v marks a point on that pad's centre or on a via)
+3.3V  (1 unrouted)
  Top 0.254: 8.89,50.8 10.16,49.53 27.94,49.53 29.21,50.8 SV1.17 | 46.99,25.4 44.45,25.4 | 52.07,22.86 49.53,22.86 | 52.07,22.86 54.61,22.86 R7.1 | 52.07,22.86 R4.1 | 49.53,22.86 46.99,25.4 | 46.99,25.4 R3.1 | 49.53,22.86 R5.1 | C3.+ 31.75,19.05 33.02,20.32 34.29,20.32 34.29,26.67 IC2.4 | 36.83,29.21 36.83,31.75 IC1.9 | 36.83,29.21 35.56,27.94 IC2.4 | 21.59,29.21 JP6.2 | 36.83,29.21 21.59,29.21 | 44.45,25.4 43.18,26.67 35.56,26.67 IC2.4 | 44.45,25.4 R6.1 | 8.89,50.8 5.08,46.99 5.08,30.48 6.35,29.21 21.59,29.21 | 8.89,50.8 SV1.1
+5V
  Top 0.254: SV1.2 8.89,53.34 11.43,53.34 SV1.4
  Route2 0.254: JP6.3 21.59,29.21 20.32,30.48 20.32,35.56 17.78,38.1 17.78,39.37 6.35,50.8 8.89,53.34 SV1.2
+12V
  Top 0.254: 38.1,19.05 36.83,20.32 36.83,21.59 IC2.3 | 57.15,20.32 57.15,19.05 55.88,17.78 53.34,17.78 52.07,16.51 X3.5 | 57.15,20.32 C1.1 | 38.1,19.05 39.37,20.32 57.15,20.32 | 38.1,19.05 C2.+
  Bottom 0.254: 17.78,15.24 19.05,16.51 X2.5 | 12.7,15.24 8.89,15.24 3.81,10.16 X1.1 | 12.7,15.24 17.78,15.24 | 12.7,31.75 13.97,31.75 16.51,29.21 21.59,29.21 JP6.4 | 12.7,31.75 7.62,31.75 3.81,35.56 D1.C | 12.7,31.75 12.7,15.24 | 17.78,15.24 24.13,15.24 26.67,17.78 49.53,17.78 50.8,16.51 X3.5
A0  (via drill 0.61)
  Top 0.254: v50.8,21.59 48.26,21.59 46.99,22.86 R3.2
  Route2 0.254: v50.8,21.59 50.8,38.1 49.53,39.37 IC1.15
  Route15 0.254: v41.91,15.24 46.99,20.32 49.53,20.32 v50.8,21.59
  Bottom 0.254: S1.6 40.64,15.24 v41.91,15.24
A1  (via drill 0.61)
  Top 0.254: v53.34,26.67 52.07,25.4 R4.2
  Bottom 0.254: 58.42,26.67 v53.34,26.67 | 58.42,26.67 59.69,27.94 59.69,35.56 58.42,36.83 49.53,36.83 46.99,39.37 IC1.16 | S1.7 39.37,16.51 44.45,16.51 45.72,15.24 54.61,15.24 58.42,19.05 58.42,26.67
A2  (via drill 0.61)
  Top 0.254: v39.37,35.56 38.1,34.29 38.1,30.48 40.64,27.94 46.99,27.94 49.53,25.4 R5.2
  Route15 0.254: v34.29,13.97 34.29,27.94 38.1,31.75 38.1,34.29 v39.37,35.56
  Bottom 0.254: v39.37,35.56 40.64,36.83 41.91,36.83 44.45,39.37 IC1.17 | v34.29,13.97 S1.8
BTN0  (via drill 0.61)
  Top 0.254: v13.97,36.83 13.97,40.64 JP1.1
  Bottom 0.254: v13.97,36.83 15.24,35.56 30.48,35.56 34.29,39.37 IC1.21
BTN1
  Top 0.254: JP1.2 7.62,43.18 6.35,44.45 6.35,45.72 7.62,46.99 11.43,46.99 15.24,43.18 29.21,43.18 31.75,40.64 IC1.22
BTN2
  Bottom 0.254: JP1.3 10.16,41.91 27.94,41.91 29.21,40.64 IC1.23
BTN3
  Bottom 0.254: JP1.4 13.97,38.1 15.24,36.83 24.13,36.83 26.67,39.37 IC1.24
BTN4
  Top 0.254: JP1.5 20.32,35.56 24.13,39.37 IC1.25
BTN5
  Top 0.254: JP1.6 10.16,34.29 20.32,34.29 21.59,35.56 24.13,35.56 25.4,36.83 25.4,40.64 24.13,41.91 22.86,41.91 21.59,40.64 IC1.26
BTN6
  Route15 0.254: JP1.7 17.78,39.37 19.05,39.37 IC1.27
BTN7
  Bottom 0.254: JP1.8 6.35,30.48 2.54,30.48 1.27,31.75 1.27,36.83 3.81,39.37 16.51,39.37 IC1.28
GND
  Top 0.254: 13.97,16.51 11.43,13.97 X2.G3 10.16,13.97 | 10.16,13.97 5.08,13.97 3.81,15.24 X1.2 | 10.16,13.97 10.16,7.62 X2.G1 11.43,6.35 26.67,6.35 | IC2.1 33.02,22.86 31.75,24.13 19.05,24.13 JP6.1 13.97,26.67 | 13.97,26.67 5.08,26.67 3.81,27.94 D1.A | 13.97,26.67 13.97,16.51 | 13.97,16.51 X2.1 | 26.67,6.35 27.94,6.35 S1.1 31.75,3.81 33.02,3.81 S1.2 34.29,3.81 35.56,3.81 S1.3 40.64,7.62 41.91,7.62 | C3.- 31.75,15.24 38.1,15.24 C2.- 38.1,13.97 41.91,13.97 | 41.91,13.97 41.91,7.62 | 41.91,13.97 X3.G3 43.18,13.97 45.72,16.51 X3.1 46.99,16.51 48.26,15.24 58.42,15.24 | 41.91,7.62 X3.G1 | 57.15,25.4 58.42,24.13 58.42,15.24 | 58.42,15.24 58.42,13.97 X3.G4 60.33,12.06 60.33,8.26 X3.G2 | 53.34,29.21 41.91,29.21 39.37,31.75 IC1.10 | 57.15,25.4 53.34,29.21 | 57.15,25.4 C1.2 | 53.34,29.21 59.69,29.21 60.96,30.48 60.96,46.99 57.15,50.8 SV1.39 | 26.67,6.35 X2.G2
  Bottom 0.254: 19.05,49.53 19.05,45.72 JP5.2 | 19.05,49.53 19.05,50.8 SV1.9 | 19.05,49.53 27.94,49.53 | 27.94,49.53 29.95,49.53 | 29.95,49.53 38.1,49.53 | 38.1,49.53 38.1,50.8 SV1.25 40.08,52.45 42.82,52.45 43.92,53.55 SV1.30 45.23,52.44 48.01,52.44 48.26,52.7 49,53.44 SV1.34 | 38.1,49.53 55.88,49.53 57.15,50.8 SV1.39 | 27.94,49.53 JP7.2 | SV1.20 29.95,52.49 29.95,49.53 | SV1.9 17.25,52.48 14.86,52.48 13.59,53.75 SV1.6 | SV1.14 22.3,52.46 19.3,52.46 18.52,51.67 SV1.9
GPIO4
  Route2 0.254: SV1.7 16.51,50.8 17.78,49.53 26.67,49.53 31.75,44.45 36.83,44.45 41.91,39.37 IC1.18
  Route15 0.254: IC1.18 41.91,39.37 35.56,33.02 35.56,31.75 24.13,20.32 22.86,20.32 21.59,19.05 X2.6
  Bottom 0.254: X3.6 52.07,19.05 49.53,21.59 24.13,21.59 21.59,19.05 X2.6
I2C_SCL  (via drill 0.61)
  Top 0.254: v41.91,22.86 44.45,22.86 R6.2
  Route2 0.254: v41.91,22.86 48.26,16.51 X3.3
  Route15 0.254: v12.7,36.83 13.97,38.1 13.97,50.8 SV1.5 | JP3.2 50.8,38.1 44.45,31.75 IC1.12
  Bottom 0.254: 29.21,34.29 43.18,34.29 44.45,33.02 IC1.12 | 29.21,34.29 27.94,33.02 27.94,22.86 | v41.91,22.86 27.94,22.86 | 27.94,22.86 15.24,22.86 13.97,21.59 13.97,19.05 16.51,16.51 X2.3 | v12.7,36.83 15.24,34.29 29.21,34.29
I2C_SDA  (via drill 0.61)
  Top 0.254: v53.34,21.59 55.88,21.59 55.88,24.13 54.61,25.4 R7.2
  Route2 0.254: v53.34,21.59 50.8,19.05 X3.4 49.53,19.05 49.53,29.21 46.99,31.75 IC1.13
  Bottom 0.254: X2.4 19.05,19.05 20.32,17.78 25.4,17.78 27.94,20.32 48.26,20.32 49.53,19.05 X3.4 | 45.72,43.18 45.72,44.45 46.99,45.72 JP3.1 | 45.72,43.18 45.72,38.1 46.99,36.83 46.99,33.02 IC1.13 | 45.72,43.18 12.7,43.18 11.43,44.45 11.43,50.8 SV1.3
LED0
  Route15 0.254: JP2.1 54.61,48.26 33.02,48.26 25.4,40.64 25.4,39.37 24.13,38.1 22.86,38.1 16.51,31.75 IC1.1
LED1
  Route15 0.254: JP2.2 53.34,46.99 46.99,46.99 40.64,40.64 40.64,39.37 34.29,33.02 20.32,33.02 19.05,31.75 IC1.2
LED2
  Route2 0.254: JP2.3 53.34,44.45 49.53,44.45 45.72,40.64 45.72,31.75 44.45,30.48 22.86,30.48 21.59,31.75 IC1.3
LED3
  Top 0.254: JP2.4 52.07,43.18 34.29,43.18 32.77,41.66 32.77,37.85 31.75,36.83 27.94,36.83 24.13,33.02 IC1.4
LED4
  Top 0.254: JP2.5 50.8,41.91 36.83,41.91 35.31,40.39 35.31,37.85 34.29,36.83 33.66,36.83 31.11,34.29 27.94,34.29 26.67,33.02 IC1.5
LED5  (via drill 0.61)
  Route15 0.254: v38.1,25.4 49.53,25.4 JP2.6
  Bottom 0.254: v38.1,25.4 35.56,25.4 29.21,31.75 IC1.6
LED6
  Top 0.254: JP2.7 50.8,36.83 36.2,36.83 34.92,35.56 34.29,35.56 31.75,33.02 IC1.7
LED7
  Bottom 0.254: JP2.8 38.1,27.94 34.29,31.75 IC1.8
N$1
  pour Bottom: 0,55.88 65.41,55.88 65.41,0 0,0
N$2
  pour Top: 0,55.88 65.41,55.88 65.41,0 0,0
PWM
  Route15 0.254: SV1.12 22.31,52.5 22.31,48.17 24.76,45.72 JP7.1
RXD
  Route15 0.254: JP5.3 20.32,48.83 19.84,49.31 19.84,52.44 SV1.10
SPI_CE0_N
  Top 0.254: JP4.4 40.64,46.61 37.64,49.61 37.63,49.61 37.51,49.73 37.51,52.54 SV1.24
SPI_CE1_N
  Top 0.254: JP4.5 43.18,46.33 40.09,49.42 40.09,52.5 SV1.26
SPI_CLK
  Top 0.254: JP4.3 36.83,46.99 36.83,50.8 SV1.23
SPI_MISO
  Top 0.254: JP4.1 34.29,46.99 34.29,50.8 SV1.21
SPI_MOSI
  Top 0.254: JP4.2 33.02,43.18 31.75,43.18 30.48,44.45 30.48,49.53 30.48,50.8 SV1.19
TXD
  Route15 0.254: JP5.1 15.24,47.44 17.28,49.48 17.28,52.45 SV1.8

### Text on the board
tPlace: UART | PWM | SPI | I²C | 1 | 1 | TxD | GND | RxD | PWM | GND | MISO | MOSI | SCK | /SS0 | /SS1 | SDA | SCL | DB8FS 2016 | Ext-GPIOA (BTN) | Ext-GPIOB (LED) | GND | +3.3V | +5V | +12V